# Altium schematic sheet cs301_group5_sensors.SchDoc
size A4; SheetNumber: 2; SheetTotal: 2
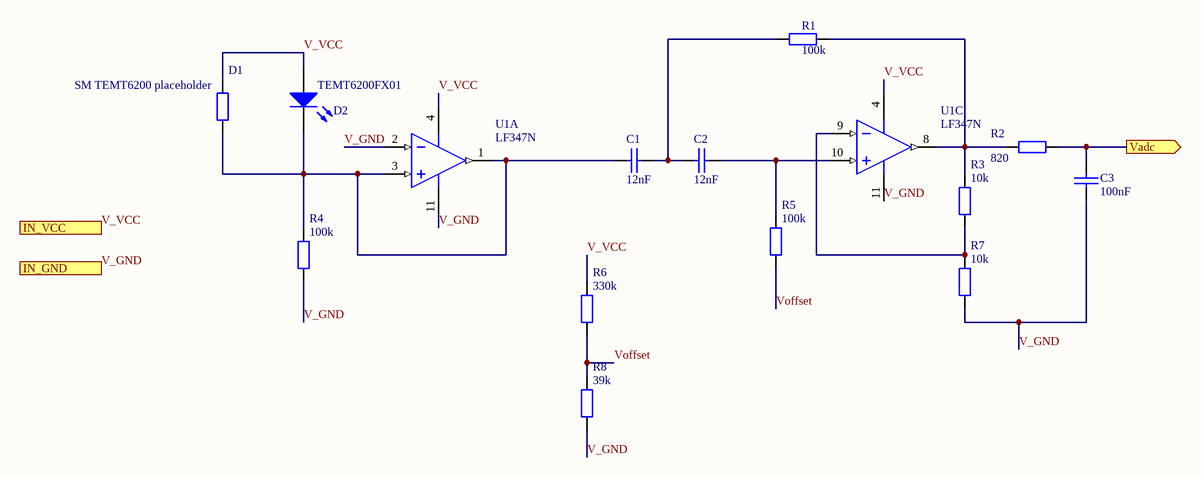
[diagram p0: cs301_group5_sensors.SchDoc]

## Parts
C1  12nF  [CCAP-5P0]
C2  12nF  [CCAP-5P0]
C3  100nF  [CCAP-5P0]
D1  SM TEMT6200 placeholder  [AXIAL-0.4]
D2  TEMT6200FX01  [0805 LED]
R1  100k  [AXIAL-0.4]
R2  820  [AXIAL-0.4]
R3  10k  [AXIAL-0.4]
R4  100k  [AXIAL-0.4]
R5  100k  [AXIAL-0.4]
R6  330k  [AXIAL-0.4]
R7  10k  [AXIAL-0.4]
R8  39k  [AXIAL-0.4]
U1  LF347N  [N0014A]  (parts A,C of 4)

## Ports
IN_GND (in), IN_VCC (in), Vadc (out)

## Nets
V_GND: C3.2 R4.1 R7.1 R8.1 U1.2(IN1-) U1.11(V-) ; port IN_GND
V_VCC: D1.2 D2.1(A) R6.2 U1.4(V+) ; port IN_VCC
Vadc: C3.1 R2.1 ; port Vadc
Voffset: R5.1 R6.1 R8.2
NetC1_1: C1.1 D1.1 D2.2(K) R4.2 U1.1(OUT1) U1.3(IN1+)
NetC1_2: C1.2 C2.1 R1.1
NetC2_2: C2.2 R5.2 U1.10(IN3+)
NetR1_2: R1.2 R2.2 R3.2 U1.8(OUT3)
NetR3_1: R3.1 R7.2 U1.9(IN3-)

## Library data of the parts
C1-C3 = CerCap_TH_5P0: SMT ceramic capacitor 0805 size; Value: *
D1 = Res_TH_0AX4: Published: 8-Jun-2000; LatestRevisionDate: 17-Jul-2002; LatestRevisionNote: Re-released for DXP Platform.; PackageReference: AXIAL-0.4; Publisher: Altium Limited; Value: *; ComponentLink1Description: http://www.royalohm.com/pdf/product2017/PrecisionMetalMF.pdf
D2 = LED_SMT_0805: SMT LED 0805 size; Manufacturer: Lite-On Inc.; Manufacturer Part Number: LTST-C170KGKT; Color: Green; Lens Color: Colorless; Lens Transparency: Clear; Millicandela Rating: 35mcd; Lens Style/Size: Rectangle with Flat Top, 1.40mm x 1.25mm; Voltage - Forward (Vf) (Typ): 2V; Current - Test: 20mA; Viewing Angle: 130°; Wavelength - Dominant: 571nm; Wavelength - Peak: 574nm; Supplier 1: Digi-Key; RoHS: RoHS Compliant; Category: Optoelectronics; Stock 1: 503069; Pricing 1: 1=0.62, 10=0.459, 25=0.338, 100=0.2415, 250=0.16416, 500=0.14486, 1000=0.11347 (NZD); Packaging: Cut Tape (CT); Part Status: Active; Mounting Type: Surface Mount; Features: -; Package / Case: 0805 (2012 Metric); Size / Dimension: 2.00mm L x 1.25mm W; Height (Max): 1.10mm; ComponentLink1URL: http://optoelectronics.liteon.com/upload/download/DS22-2000-073/LTST-C170KGKT.pdf; ComponentLink1Description: http://optoelectronics.liteon.com/upload/download/DS22-2000-073/LTST-C170KGKT.pdf; Supplier Part Number 1: 160-1414-1-ND; Supplier 2: RSComponents
R1-R8 = Res_TH_0AX4: Through hole resistor; Published: 8-Jun-2000; LatestRevisionDate: 17-Jul-2002; LatestRevisionNote: Re-released for DXP Platform.; PackageReference: AXIAL-0.4; Publisher: Altium Limited; Value: *; ComponentLink1Description: http://www.royalohm.com/pdf/product2017/PrecisionMetalMF.pdf
U1 = CMP-0055-00229-3: Wide Bandwidth Quad JFET Input Operational Amplifier, 14-pin MDIP; Manufacturer: Texas Instruments; PowerWise: N; PackageTopMarking: NSUZXYYTTE#*LF347N; CompType: Amplifiers; RoHS: N; PinCount: 14; Package Reference: N0014A; PackageDescription: MDIP, .750 x .250 x.130in, 14 Lead, .100in Pitch; ComponentLink1Description: Datasheet URL; ComponentLink1URL: http://www.ti.com/general/docs/lit/getliterature.tsp?genericPartNumber=LF347&fileType=pdf; Code_JEDEC: MS-001-AA